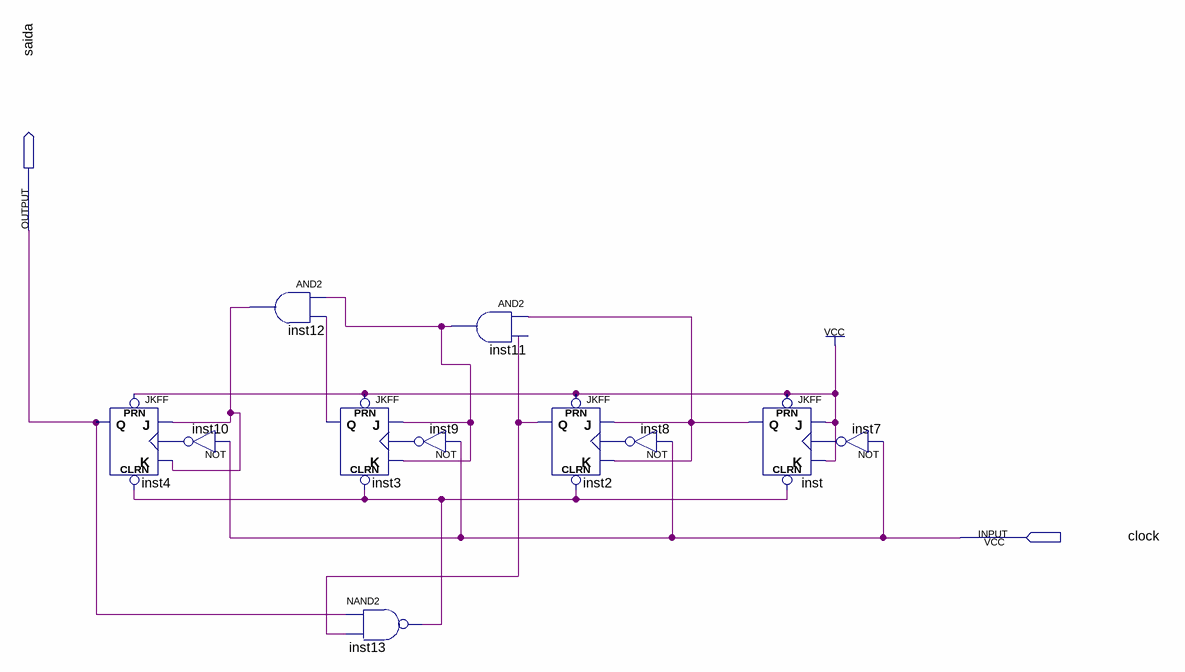
[diagram p0: schematic sheet]
// Quartus schematic Divisor.bdf as structural Verilog: 11 symbols, 2 pins
module Divisor (
  input  clock,
  output saida
);

  wire inst2_q, inst3_q, inst7_out, inst8_out, inst9_out, inst10_out, inst11_out, inst12_out, inst13_out,
       inst_q;

  JKFF inst4 (.PRN(1'b1), .CLRN(inst13_out), .K(inst12_out), .J(inst12_out), .CLK(inst10_out), .Q(saida));
  not inst10 (inst10_out, clock);
  and inst12 (inst12_out, inst11_out, inst3_q);
  JKFF inst3 (.PRN(1'b1), .CLRN(inst13_out), .K(inst11_out), .J(inst11_out), .CLK(inst9_out), .Q(inst3_q));
  nand inst13 (inst13_out, saida, inst2_q);
  not inst9 (inst9_out, clock);
  and inst11 (inst11_out, inst_q, inst2_q);
  JKFF inst2 (.PRN(1'b1), .CLRN(inst13_out), .K(inst_q), .J(inst_q), .CLK(inst8_out), .Q(inst2_q));
  not inst8 (inst8_out, clock);
  JKFF inst (.PRN(1'b1), .CLRN(inst13_out), .K(1'b1), .J(1'b1), .CLK(inst7_out), .Q(inst_q));
  not inst7 (inst7_out, clock);
endmodule
